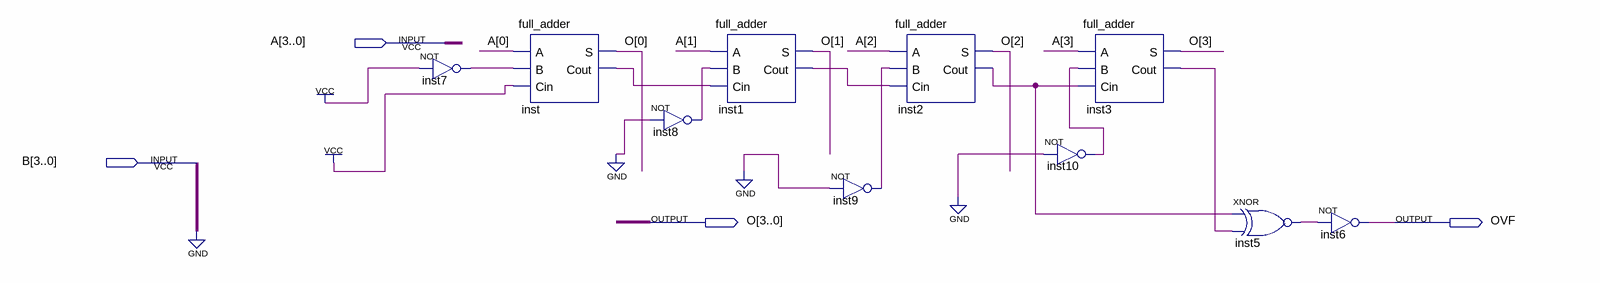
[diagram p0: schematic sheet]
// Quartus schematic sub_1.bdf as structural Verilog: 10 symbols, 4 pins
module sub_1 (
  input  [3:0] A,
  input  [3:0] B,
  output [3:0] O,
  output OVF
);

  wire inst1_cout, inst2_cout, inst3_cout, inst5_out, inst7_out, inst8_out, inst9_out, inst10_out, inst_cout;

  not inst7 (inst7_out, 1'b1);
  full_adder inst (.A(A[0]), .B(inst7_out), .Cin(1'b1), .S(O[0]), .Cout(inst_cout));
  not inst8 (inst8_out, 1'b0);
  full_adder inst1 (.A(A[1]), .B(inst8_out), .Cin(inst_cout), .S(O[1]), .Cout(inst1_cout));
  not inst9 (inst9_out, 1'b0);
  full_adder inst2 (.A(A[2]), .B(inst9_out), .Cin(inst1_cout), .S(O[2]), .Cout(inst2_cout));
  not inst10 (inst10_out, 1'b0);
  full_adder inst3 (.A(A[3]), .B(inst10_out), .Cin(inst2_cout), .S(O[3]), .Cout(inst3_cout));
  xnor inst5 (inst5_out, inst2_cout, inst3_cout);
  not inst6 (OVF, inst5_out);
  // also tied to GND on the sheet: {B[0], B[1], B[2], B[3]}
endmodule
